# Altium schematic sheet PAGE3.SchDoc
size 246 x 182 mm
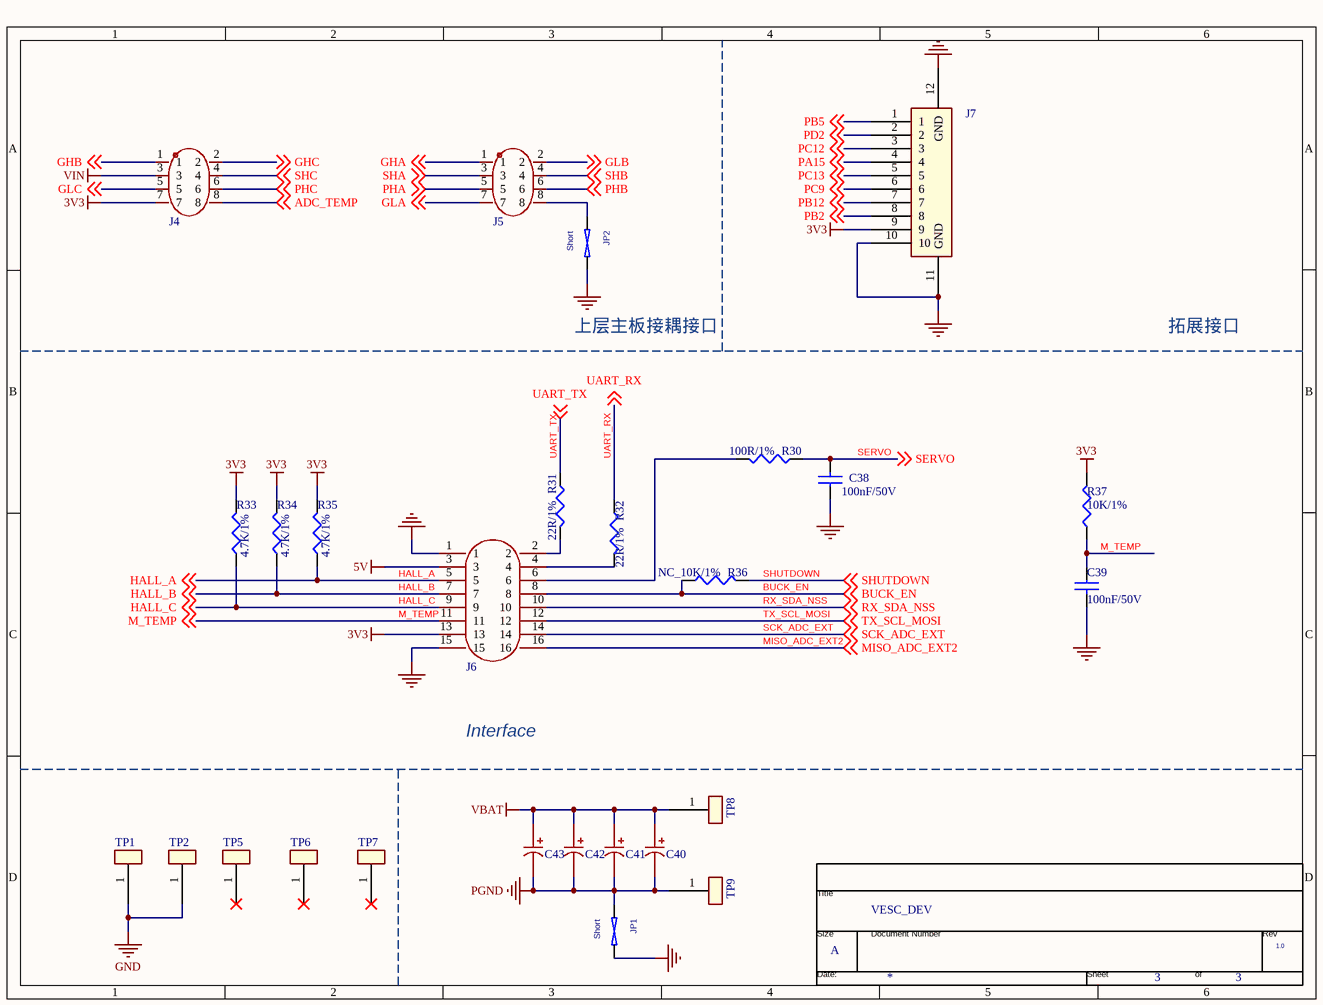
[diagram p0: PAGE3.SchDoc]

## Parts
*  Page Count: 3  Page Size: A  Title: VESC_DEV  RevCode: 1.0  (hidden comment: TitleBlock0)  (graphical)
C38  100nF/50V  [C0402]
C39  100nF/50V  [C0402]
C40  680uF  [CAP-TH_BD10.0-P5.00-D0.6-FD]  (value not drawn)
C41  680uF  [CAP-TH_BD10.0-P5.00-D0.6-FD]  (value not drawn)
C42  680uF  [CAP-TH_BD10.0-P5.00-D0.6-FD]  (value not drawn)
C43  680uF  [CAP-TH_BD10.0-P5.00-D0.6-FD]  (value not drawn)
J4  X6521WVS-2x04H-C60D74  [HDR-SMD_8P-P1.27-V-M-C2-C4-LS5.3]  (value not drawn)
J5  X6521WVS-2x04H-C60D74  [HDR-SMD_8P-P1.27-V-M-C2-C4-LS5.3]  (value not drawn)
J6  HC-5557-2*8A  [CONN-TH_HC5557-2X8A]  (value not drawn)
J7  1.25-10GH_1  [CONN-SMD_10P-P1.25_JS_GH125-S10CCA-00]  (value not drawn)
JP1  Short  [SHORT]
JP2  Short  [SHORT]
R30  100R/1%  [R0402]
R31  22R/1%  [R0402]
R32  22R/1%  [R0402]
R33  4.7K/1%  [R0402]
R34  4.7K/1%  [R0402]
R35  4.7K/1%  [R0402]
R36  NC_10K/1%  [R0402]
R37  10K/1%  [R0402]
TP1  TEST POINT  [HOLE-4MM_M]  (value not drawn)
TP2  TEST POINT  [HOLE-4MM_M]  (value not drawn)
TP5  TEST POINT  [HOLE-8MM_M]  (value not drawn)
TP6  TEST POINT  [HOLE-8MM_M]  (value not drawn)
TP7  TEST POINT  [HOLE-8MM_M]  (value not drawn)
TP8  TEST POINT  [HOLE-8MM_M]  (value not drawn)
TP9  TEST POINT  [HOLE-8MM_M]  (value not drawn)

## Nets
3V3: J4.7 J6.13 J7.9 R33.2 R34.2 R35.2 R37.2
5V: J6.3
GND: C38.1 C39.2 J6.1 J6.15 J7.10 J7.11(GND) J7.12(GND) JP1.2 JP2.2 TP1.1 TP2.1
PGND: C40.2 C41.2 C42.2 C43.2 JP1.1 TP9.1
VBAT: C40.1 C41.1 C42.1 C43.1 TP8.1
VIN: J4.3
ADC_TEMP: J4.8 ; off-sheet ADC_TEMP
BUCK_EN: J6.8 R36.2 ; off-sheet BUCK_EN
GHA: J5.1 ; off-sheet GHA
GHB: J4.1 ; off-sheet GHB
GHC: J4.2 ; off-sheet GHC
GLA: J5.7 ; off-sheet GLA
GLB: J5.2 ; off-sheet GLB
GLC: J4.5 ; off-sheet GLC
HALL_A: J6.5 R35.1 ; off-sheet HALL_A
HALL_B: J6.7 R34.1 ; off-sheet HALL_B
HALL_C: J6.9 R33.1 ; off-sheet HALL_C
M_TEMP: C39.1 J6.11 R37.1 ; off-sheet M_TEMP
MISO_ADC_EXT2: J6.16 ; off-sheet MISO_ADC_EXT2
PA15: J7.4 ; off-sheet PA15
PB2: J7.8 ; off-sheet PB2
PB5: J7.1 ; off-sheet PB5
PB12: J7.7 ; off-sheet PB12
PC9: J7.6 ; off-sheet PC9
PC12: J7.3 ; off-sheet PC12
PC13: J7.5 ; off-sheet PC13
PD2: J7.2 ; off-sheet PD2
PHA: J5.5 ; off-sheet PHA
PHB: J5.6 ; off-sheet PHB
PHC: J4.6 ; off-sheet PHC
RX_SDA_NSS: J6.10 ; off-sheet RX_SDA_NSS
SCK_ADC_EXT: J6.14 ; off-sheet SCK_ADC_EXT
SERVO: C38.2 R30.2 ; off-sheet SERVO
SHA: J5.3 ; off-sheet SHA
SHB: J5.4 ; off-sheet SHB
SHC: J4.4 ; off-sheet SHC
SHUTDOWN: R36.1 ; off-sheet SHUTDOWN
TX_SCL_MOSI: J6.12 ; off-sheet TX_SCL_MOSI
UART_RX: R32.2 ; off-sheet UART_RX
UART_TX: R31.2 ; off-sheet UART_TX
NetJ5_8: J5.8 JP2.1
NetJ6_2: J6.2 R31.1
NetJ6_4: J6.4 R32.1
NetJ6_6: J6.6 R30.1

Not connected (* = marked no-connect by the designer): TP5 1*; TP6 1*; TP7 1*

## Notes on the sheet
- 上层主板接耦接口
- 拓展接口
- Interface
- (in symbol TitleBlock0) Title; Size; Document Number; Rev; Date:; Sheet; of

## Library data of the parts
C38 C39 = CAP NP: PCB Footprint: C0402
C40-C43 = ERS1VM681G16OT: 容值:680uF;精度:±20%;额定电压:35V;纹波电流:-;等效串联电阻:-;; Manufacturer: AISHI(艾华集团); Add into BOM: yes; Tolerance: ±20%; Rated Voltage: 35V; Symbol: ERS1VM681G16OT; Device: ERS1VM681G16OT; LCSC Part Name: 680uF ±20% 35V; Supplier Part: C721283; Manufacturer Part: ERS1VM681G16OT; Supplier Footprint: 插件,D10xL16mm; Datasheet: https://atta.szlcsc.com/upload/public/pdf/source/20191015/C438940_4B8E60A742BB0AE40DDEF87A5C89089D.pdf; Supplier: LCSC; Convert to PCB: yes; Value: 680uF; Ripple Current: -; Equivalent Series Resistance(ESR): -; Lead Spacing: -; φD: -; L: -; Lifetime @ Temp: -
J4 J5 = X6521WVS-2x04H-C60D74: Manufacturer: XKB Connection(中国星坤); Symbol: X6521WVS-2*04H-C60D74; Add into BOM: yes; Pin Structure: 2x4P; Pitch: 2.54mm; Circluar Pins/Square Pins: 方针; Current Rating (Max): 3A; Voltage Rating (Max): 250V; Soldering Temperature(Max): 260℃; Device: X6521WVS-2x04H-C60D74; LCSC Part Name: 2x4P 间距:2.54mm 方针; Supplier Part: C780053; Manufacturer Part: X6521WVS-2x04H-C60D74; Supplier Footprint: SMD,P=2.54mm; JLCPCB Part Class: Extended Part; Datasheet: https://atta.szlcsc.com/upload/public/pdf/source/20211009/E3239EE5247E6BAFECB8B74A4FCF9AB8.pdf; Supplier: LCSC; Convert to PCB: yes; Row Spacing: 2.54mm; Mounting Type: -; Number of Rows: 双排; Number of Pins: 8P; Length of Mating Pin: -; Insulation Height: 2.5mm; Length of End Connection Pin: -; Contact Material: 黄铜; Contact Plating: 金; Operating Temperature Range: -40℃~+105℃; Color: 黑色
J6 = HC-5557-2*8A: 插针结构:2x8P;间距:4.2mm;安装方式:直插;参考系列:Mini-Fit(MX 4.2);总PIN数:16P;排数:2;每排PIN数:8;行距:4.2mm;额定电流:9A;触头材质:黄铜;触头镀层:锡;工作温度范围:-25℃~+85℃;; Manufacturer: HCTL(华灿天禄); Add into BOM: yes; Pins Structure: 2x8P; Pitch: 4.2mm; Number of PINs Per Row: 8; Current Rating (Max): 9A; Rated Voltage (Max): 600V; Plastic Material: PA66; Flame Retardant Rating: UL94V-0; Z-Height of the Board: 13.1mm; X-Length of Bottom Edge on Board (Spacing Line): 34.8mm; Y-Width of Bottom Edge on Board: 11.4mm; Symbol: HC-5557-2*8A; Device: HC-5557-2*8A; LCSC Part Name: 2x8P 间距:4.2mm 直插 系列:Mini-Fit(MX 4.2); Supplier Part: C2845783; Manufacturer Part: HC-5557-2*8A; Supplier Footprint: 插件,P=4.2mm; Datasheet: https://atta.szlcsc.com/upload/public/pdf/source/20230620/FF5B1F4AE343F4430EEB0EA0134778E8.pdf; Supplier: LCSC; Convert to PCB: yes; Mounting Style: 直插; Reference Series: Mini-Fit(MX 4.2); Number of Pins: 16P; Number of Rows: 2; Row Spacing: 4.2mm; Contact Material: 黄铜; Contact Plating: 锡; Operating Temperature Range: -25℃~+85℃; Supplementary Features: -; Colour: -
JP1 JP2 = SHORT: 2 PIN SHORTED TO CONNECT DIFFERENT NETS; PART_NUMBER: TMP-442; CLASS: DISCRETE
R30-R37 = RESISTOR: PCB Footprint: R0402
* = TitleBlock0: Page Number: 3; Page Create Date: March  8, 1995; Page Modify Date: *